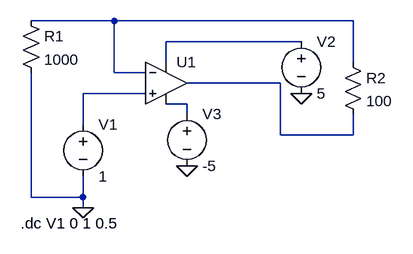
[diagram p0: schematic core_comparator_stage.asc]
core_comparator_stage.asc, the LTspice schematic file:
Version 4
SHEET 1 880 680
WIRE 96 64 -32 64
WIRE 464 64 96 64
WIRE 384 96 176 96
WIRE 176 128 176 96
WIRE 464 128 464 64
WIRE 96 144 96 64
WIRE 144 144 96 144
WIRE 352 160 208 160
WIRE 144 176 48 176
WIRE 208 192 176 192
WIRE 208 208 208 192
WIRE 48 224 48 176
WIRE 352 240 352 160
WIRE 464 240 464 208
WIRE 464 240 352 240
WIRE -32 336 -32 144
WIRE 48 336 48 304
WIRE 48 336 -32 336
WIRE 48 352 48 336
FLAG 48 352 0
FLAG 384 176 0
FLAG 208 288 0
SYMBOL OpAmps\\UniversalOpAmp 176 160 R0
SYMATTR InstName U1
SYMBOL res -48 48 R0
SYMATTR InstName R1
SYMATTR Value 1000
SYMBOL res 448 112 R0
SYMATTR InstName R2
SYMATTR Value 100
SYMBOL voltage 48 208 R0
WINDOW 123 0 0 Left 0
WINDOW 39 0 0 Left 0
SYMATTR InstName V1
SYMATTR Value 1
SYMBOL voltage 384 80 R0
WINDOW 123 0 0 Left 0
WINDOW 39 0 0 Left 0
SYMATTR InstName V2
SYMATTR Value 5
SYMBOL voltage 208 192 R0
WINDOW 123 0 0 Left 0
WINDOW 39 0 0 Left 0
SYMATTR InstName V3
SYMATTR Value -5
TEXT -48 376 Left 2 !.dc V1 0 1 0.5

The netlist it stands for:
* core_comparator_stage.asc
XU1 N004 N001 N002 N005 N003 level1 Avol=1Meg GBW=10Meg Vos=0 En=0 Enk=0 In=0 Ink=0 Rin=500Meg  ; pins In+ In- V+ V- OUT
R1 N001 0 1000
R2 N001 N003 100
V1 N004 0 1
V2 N002 0 5
V3 N005 0 -5
.dc V1 0 1 0.5
.lib UniversalOpAmp1.lib
.backanno
.end